# Altium schematic sheet JTAG_chain.SchDoc
size A4
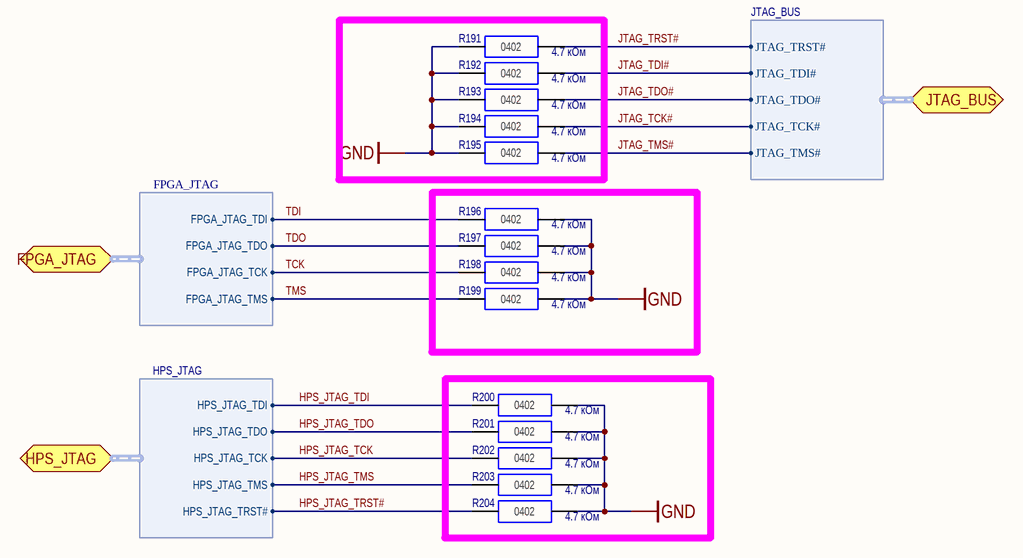
[diagram p0: JTAG_chain.SchDoc]

## Parts
R191  value 4.7 кОм  [CR0402(1005)]  (hidden comment: CR0402-4.7 кОм-±5%)
R192  value 4.7 кОм  [CR0402(1005)]  (hidden comment: CR0402-4.7 кОм-±5%)
R193  value 4.7 кОм  [CR0402(1005)]  (hidden comment: CR0402-4.7 кОм-±5%)
R194  value 4.7 кОм  [CR0402(1005)]  (hidden comment: CR0402-4.7 кОм-±5%)
R195  value 4.7 кОм  [CR0402(1005)]  (hidden comment: CR0402-4.7 кОм-±5%)
R196  value 4.7 кОм  [CR0402(1005)]  (hidden comment: CR0402-4.7 кОм-±5%)
R197  value 4.7 кОм  [CR0402(1005)]  (hidden comment: CR0402-4.7 кОм-±5%)
R198  value 4.7 кОм  [CR0402(1005)]  (hidden comment: CR0402-4.7 кОм-±5%)
R199  value 4.7 кОм  [CR0402(1005)]  (hidden comment: CR0402-4.7 кОм-±5%)
R200  value 4.7 кОм  [CR0402(1005)]  (hidden comment: CR0402-4.7 кОм-±5%)
R201  value 4.7 кОм  [CR0402(1005)]  (hidden comment: CR0402-4.7 кОм-±5%)
R202  value 4.7 кОм  [CR0402(1005)]  (hidden comment: CR0402-4.7 кОм-±5%)
R203  value 4.7 кОм  [CR0402(1005)]  (hidden comment: CR0402-4.7 кОм-±5%)
R204  value 4.7 кОм  [CR0402(1005)]  (hidden comment: CR0402-4.7 кОм-±5%)

## Ports
FPGA_JTAG (harness FPGA_JTAG), HPS_JTAG (harness HPS_JTAG), JTAG_BUS (harness JTAG_BUS)

## Harnesses
HPS_JTAG: HPS_JTAG_TDI, HPS_JTAG_TDO, HPS_JTAG_TCK, HPS_JTAG_TMS, HPS_JTAG_TRST#
JTAG_BUS: JTAG_TRST#, JTAG_TDI#, JTAG_TDO#, JTAG_TCK#, JTAG_TMS#
FPGA_JTAG: FPGA_JTAG_TDI, FPGA_JTAG_TDO, FPGA_JTAG_TCK, FPGA_JTAG_TMS

## Nets
GND: R191.1(+) R192.1(+) R193.1(+) R194.1(+) R195.1(+) R196.2(-) R197.2(-) R198.2(-) R199.2(-) R200.2(-) R201.2(-) R202.2(-) R203.2(-) R204.2(-)
HPS_JTAG_TCK: R202.1(+) ; port HPS_JTAG.HPS_JTAG_TCK
HPS_JTAG_TDI: R200.1(+) ; port HPS_JTAG.HPS_JTAG_TDI
HPS_JTAG_TDO: R201.1(+) ; port HPS_JTAG.HPS_JTAG_TDO
HPS_JTAG_TMS: R203.1(+) ; port HPS_JTAG.HPS_JTAG_TMS
HPS_JTAG_TRST#: R204.1(+) ; port HPS_JTAG.HPS_JTAG_TRST#
JTAG_TCK#: R194.2(-) ; port JTAG_BUS.JTAG_TCK#
JTAG_TDI#: R192.2(-) ; port JTAG_BUS.JTAG_TDI#
JTAG_TDO#: R193.2(-) ; port JTAG_BUS.JTAG_TDO#
JTAG_TMS#: R195.2(-) ; port JTAG_BUS.JTAG_TMS#
JTAG_TRST#: R191.2(-) ; port JTAG_BUS.JTAG_TRST#
TCK: R198.1(+) ; port FPGA_JTAG.FPGA_JTAG_TCK
TDI: R196.1(+) ; port FPGA_JTAG.FPGA_JTAG_TDI
TDO: R197.1(+) ; port FPGA_JTAG.FPGA_JTAG_TDO
TMS: R199.1(+) ; port FPGA_JTAG.FPGA_JTAG_TMS

## Notes on the sheet
- (in symbol CR0402-#-±5%) 0402

## Library data of the parts
R191-R204 = CR0402-#-±5%: Чип резистор; Maximum Working Voltage: 50 В; TOLERANCE: 5%; Supplier 1: Digi-Key; Supplier Part Number 1: 311-4.7KJRTR-ND